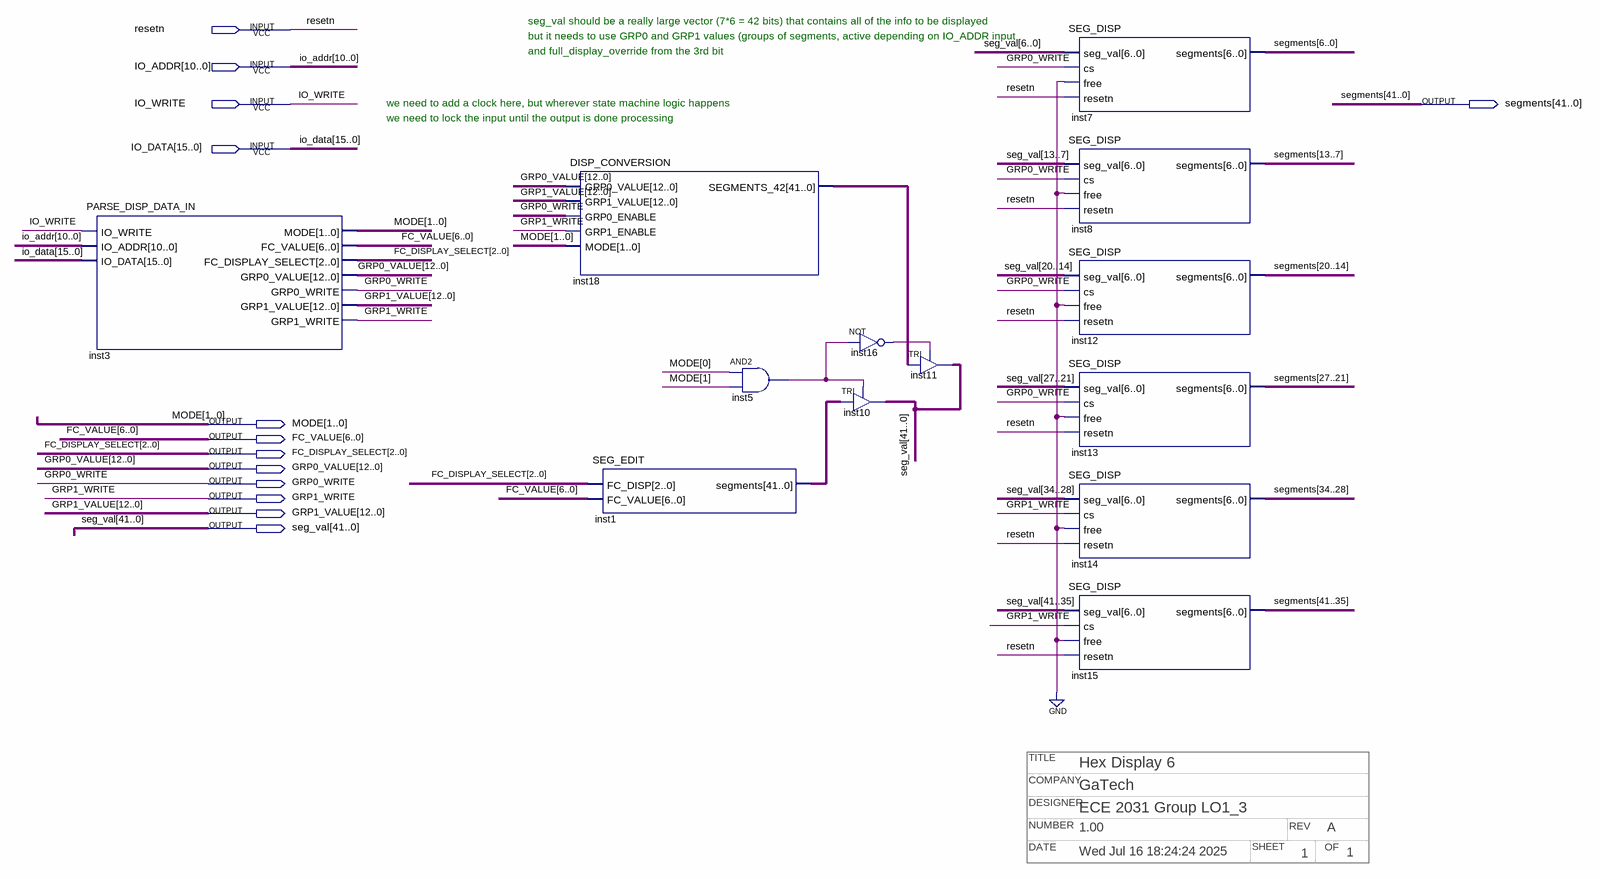
[diagram p0: schematic sheet]
// Quartus schematic HEX_DISP_6.bdf as structural Verilog: 13 symbols, 13 pins
// Title block: COMPANY: GaTech; DATE: Wed Jul 16 18:24:24 2025; DESIGNER: ECE 2031 Group LO1_3; NUMBER: 1.00; OF: 1; REV: A; SHEET: 1; TITLE: Hex Display 6
module HEX_DISP_6 (
  input  resetn,
  input  [10:0] IO_ADDR,
  input  IO_WRITE,
  input  [15:0] IO_DATA,
  output [41:0] segments,
  output [1:0] MODE,
  output [6:0] FC_VALUE,
  output [2:0] FC_DISPLAY_SELECT,
  output [12:0] GRP0_VALUE,
  output GRP0_WRITE,
  output GRP1_WRITE,
  output [12:0] GRP1_VALUE,
  output [41:0] seg_val
);

  wire inst5_out, inst16_out;
  wire [41:0] inst1_segments, inst18_segments_42;

  PARSE_DISP_DATA_IN inst3 (
    .IO_WRITE(IO_WRITE), .IO_ADDR(IO_ADDR), .IO_DATA(IO_DATA), .MODE(MODE), .FC_VALUE(FC_VALUE),
    .FC_DISPLAY_SELECT(FC_DISPLAY_SELECT), .GRP0_VALUE(GRP0_VALUE), .GRP0_WRITE(GRP0_WRITE),
    .GRP1_VALUE(GRP1_VALUE), .GRP1_WRITE(GRP1_WRITE));
  DISP_CONVERSION inst18 (
    .GRP0_VALUE(GRP0_VALUE), .GRP1_VALUE(GRP1_VALUE), .GRP0_ENABLE(GRP0_WRITE), .GRP1_ENABLE(GRP1_WRITE),
    .MODE(MODE), .SEGMENTS_42(inst18_segments_42));
  SEG_EDIT inst1 (.FC_DISP(FC_DISPLAY_SELECT), .FC_VALUE(FC_VALUE), .segments(inst1_segments));
  and inst5 (inst5_out, MODE[0], MODE[1]);
  TRI inst10[41:0] (.IN(inst1_segments), .OE(inst5_out), .OUT(seg_val));
  not inst16 (inst16_out, inst5_out);
  TRI inst11[41:0] (.IN(inst18_segments_42), .OE(inst16_out), .OUT(seg_val));
  SEG_DISP inst7 (.seg_val(seg_val[6:0]), .cs(GRP0_WRITE), .free(1'b0), .resetn(resetn), .segments(segments[6:0]));
  SEG_DISP inst8 (.seg_val(seg_val[13:7]), .cs(GRP0_WRITE), .free(1'b0), .resetn(resetn), .segments(segments[13:7]));
  SEG_DISP inst12 (.seg_val(seg_val[20:14]), .cs(GRP0_WRITE), .free(1'b0), .resetn(resetn), .segments(segments[20:14]));
  SEG_DISP inst13 (.seg_val(seg_val[27:21]), .cs(GRP0_WRITE), .free(1'b0), .resetn(resetn), .segments(segments[27:21]));
  SEG_DISP inst14 (.seg_val(seg_val[34:28]), .cs(GRP1_WRITE), .free(1'b0), .resetn(resetn), .segments(segments[34:28]));
  SEG_DISP inst15 (.seg_val(seg_val[41:35]), .cs(GRP1_WRITE), .free(1'b0), .resetn(resetn), .segments(segments[41:35]));

  // Notes on the sheet:
  //   seg_val should be a really large vector (7*6 = 42 bits) that contains all of the info to be displayed
  //   but it needs to use GRP0 and GRP1 values (groups of segments, active depending on IO_ADDR input
  //   and full_display_override from the 3rd bit
  //   we need to add a clock here, but wherever state machine logic happens
  //   we need to lock the input until the output is done processing
endmodule
